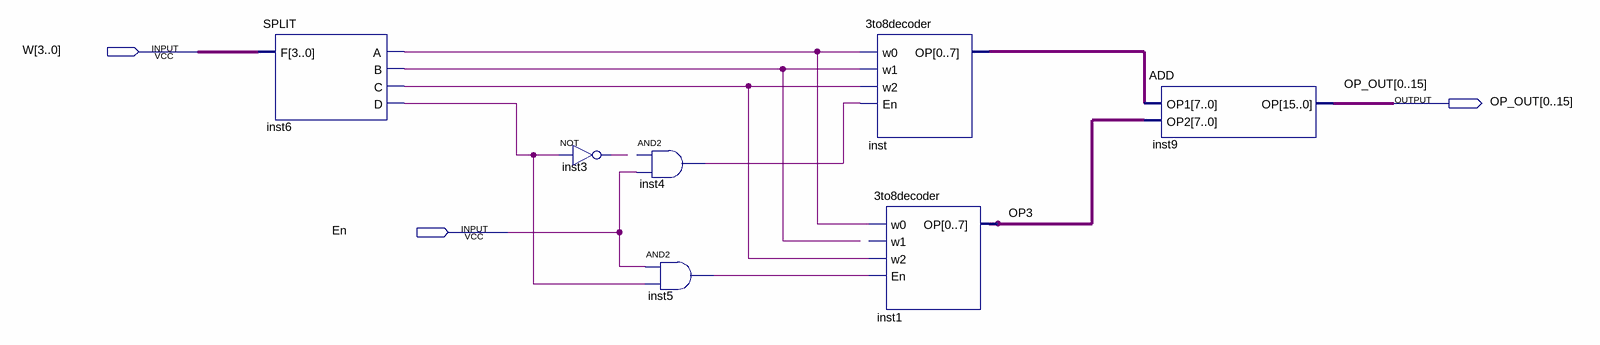
[diagram p0: schematic sheet]
// Quartus schematic 4to16.bdf as structural Verilog: 7 symbols, 3 pins
module \4to16  (
  input  [3:0] W,
  input  En,
  output [0:15] OP_OUT
);

  wire inst3_out, inst4_out, inst5_out, inst6_a, inst6_b, inst6_c, inst6_d, OP3;
  wire [7:0] inst_op;

  SPLIT inst6 (.F(W), .A(inst6_a), .B(inst6_b), .C(inst6_c), .D(inst6_d));
  not inst3 (inst3_out, inst6_d);
  buf inst4 (inst4_out, En);  // AND2 open: IN1
  and inst5 (inst5_out, En, inst6_d);
  \3to8decoder  inst (.w0(inst6_a), .w1(inst6_b), .w2(inst6_c), .En(inst4_out), .OP(inst_op));
  \3to8decoder  inst1 (.w0(inst6_a), .w2(inst6_c), .En(inst5_out), .OP(OP3));  // open: w1
  ADD inst9 (.OP1(inst_op), .OP2({8{OP3}}), .OP(OP_OUT));
endmodule
